# Altium project BMS Slave V0.1.PrjPcb (part 3 of 3)
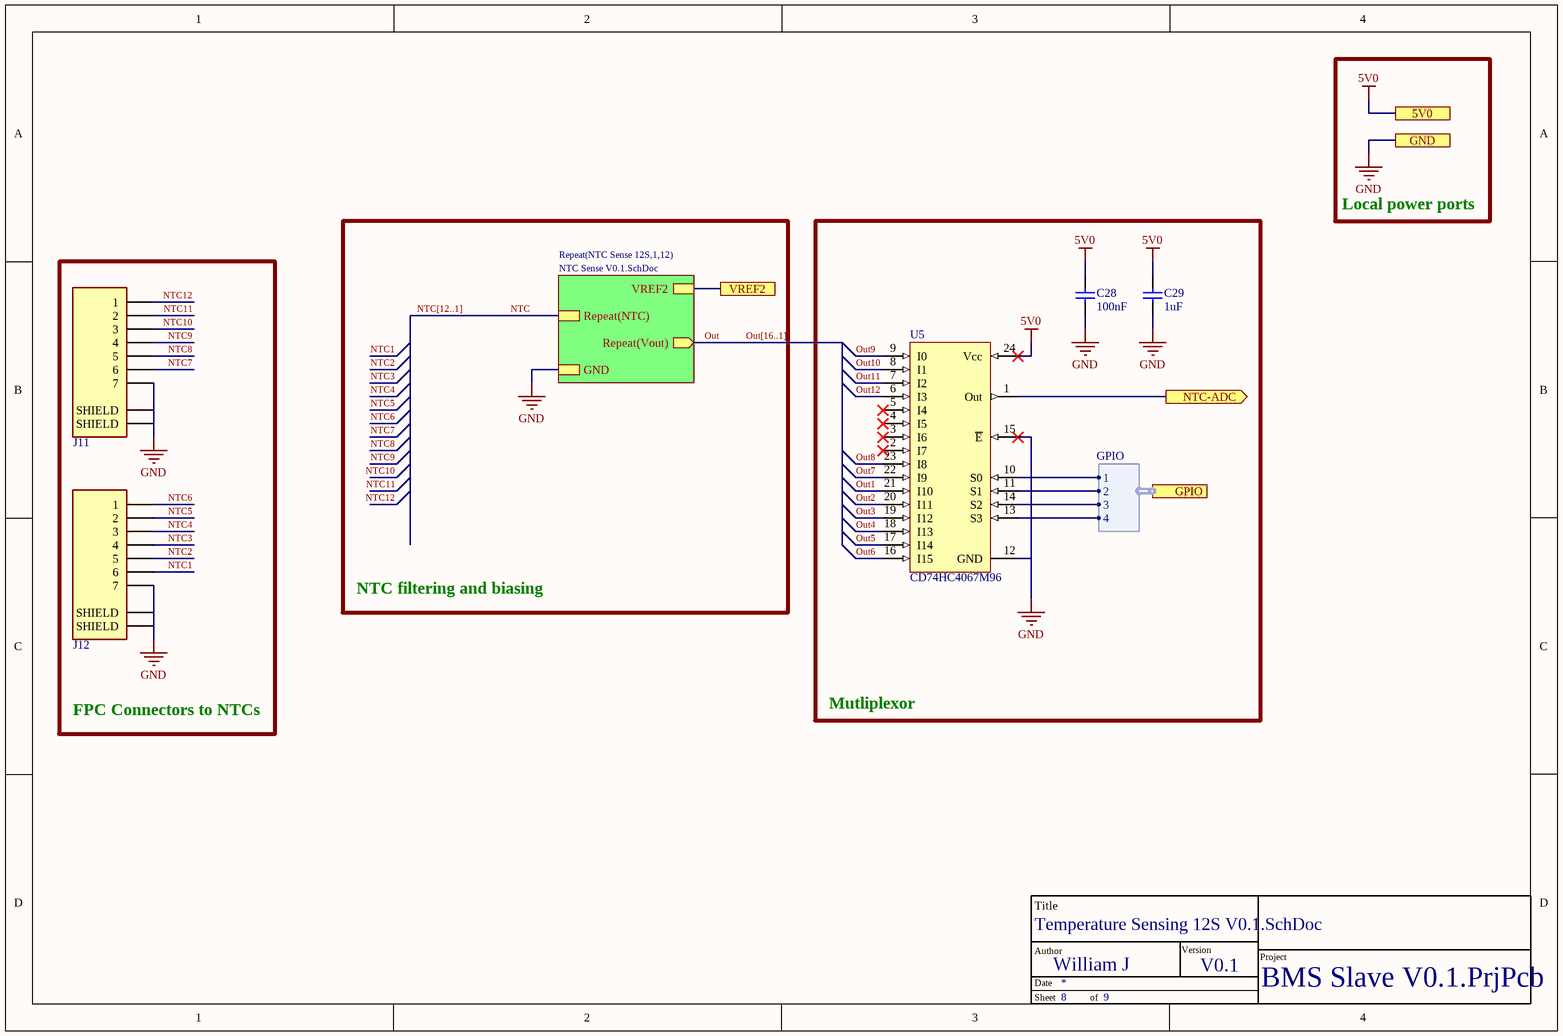
[diagram p9: Temperature Sensing 12S V0.1.SchDoc]

## Nets that join several sheets
5V0_8L: Cell Monitor 8S LHS V0.1 (14 pins), Temperature Sensing 8S LHS (C11_Temperature_Sensing_8S_LHS.1 C12_Temperature_Sensing_8S_LHS.2 U2_Temperature_Sensing_8S_LHS.24)
5V0_8R: Cell Monitor 8S RHS V0.1 (14 pins), Temperature Sensing 8S RHS (C11_Temperature_Sensing_8S_RHS.1 C12_Temperature_Sensing_8S_RHS.2 U2_Temperature_Sensing_8S_RHS.24)
5V0_12: Cell Monitor 12S V0.1 (14 pins), Temperature Sensing 12S V0.1 (C28.1 C29.2 U5.24)
GND_8L: Cell Monitor 8S LHS V0.1 (20 pins), Cell Monitor 8S LHS/Balance Circuit 8L1 (C8_Balance_Circuit_8L1.1), Cell Monitor 8S LHS/Balance Circuit 8L2 (C8_Balance_Circuit_8L2.1), Cell Monitor 8S LHS/Balance Circuit 8L3 (C8_Balance_Circuit_8L3.1), Cell Monitor 8S LHS/Balance Circuit 8L4 (C8_Balance_Circuit_8L4.1), Cell Monitor 8S LHS/Balance Circuit 8L5 (C8_Balance_Circuit_8L5.1), Cell Monitor 8S LHS/Balance Circuit 8L6 (C8_Balance_Circuit_8L6.1), Cell Monitor 8S LHS/Balance Circuit 8L7 (C8_Balance_Circuit_8L7.1), Cell Monitor 8S LHS/Balance Circuit 8L8 (C8_Balance_Circuit_8L8.1), Temperature Sensing 8S LHS (10 pins), Temperature Sensing 8S LHS/NTC Sense 8S1 (C13_Temperature_Sensing_8S_LHS_NTC_Sense_8S1.1), Temperature Sensing 8S LHS/NTC Sense 8S2 (C13_Temperature_Sensing_8S_LHS_NTC_Sense_8S2.1), Temperature Sensing 8S LHS/NTC Sense 8S3 (C13_Temperature_Sensing_8S_LHS_NTC_Sense_8S3.1), Temperature Sensing 8S LHS/NTC Sense 8S4 (C13_Temperature_Sensing_8S_LHS_NTC_Sense_8S4.1), Temperature Sensing 8S LHS/NTC Sense 8S5 (C13_Temperature_Sensing_8S_LHS_NTC_Sense_8S5.1), Temperature Sensing 8S LHS/NTC Sense 8S6 (C13_Temperature_Sensing_8S_LHS_NTC_Sense_8S6.1), Temperature Sensing 8S LHS/NTC Sense 8S7 (C13_Temperature_Sensing_8S_LHS_NTC_Sense_8S7.1), Temperature Sensing 8S LHS/NTC Sense 8S8 (C13_Temperature_Sensing_8S_LHS_NTC_Sense_8S8.1), Temperature Sensing 8S LHS/NTC Sense 8S9 (C13_Temperature_Sensing_8S_LHS_NTC_Sense_8S9.1), Temperature Sensing 8S LHS/NTC Sense 8S10 (C13_Temperature_Sensing_8S_LHS_NTC_Sense_8S10.1), Temperature Sensing 8S LHS/NTC Sense 8S11 (C13_Temperature_Sensing_8S_LHS_NTC_Sense_8S11.1), Temperature Sensing 8S LHS/NTC Sense 8S12 (C13_Temperature_Sensing_8S_LHS_NTC_Sense_8S12.1), Temperature Sensing 8S LHS/NTC Sense 8S13 (C13_Temperature_Sensing_8S_LHS_NTC_Sense_8S13.1), Temperature Sensing 8S LHS/NTC Sense 8S14 (C13_Temperature_Sensing_8S_LHS_NTC_Sense_8S14.1), Temperature Sensing 8S LHS/NTC Sense 8S15 (C13_Temperature_Sensing_8S_LHS_NTC_Sense_8S15.1), Temperature Sensing 8S LHS/NTC Sense 8S16 (C13_Temperature_Sensing_8S_LHS_NTC_Sense_8S16.1), IsoSPI 8S LHS (C10_IsoSPI_8S_LHS.1)
GND_8R: Cell Monitor 8S RHS V0.1 (20 pins), Cell Monitor 8S RHS/Balance Circuit 8R1 (C8_Balance_Circuit_8R1.1), Cell Monitor 8S RHS/Balance Circuit 8R2 (C8_Balance_Circuit_8R2.1), Cell Monitor 8S RHS/Balance Circuit 8R3 (C8_Balance_Circuit_8R3.1), Cell Monitor 8S RHS/Balance Circuit 8R4 (C8_Balance_Circuit_8R4.1), Cell Monitor 8S RHS/Balance Circuit 8R5 (C8_Balance_Circuit_8R5.1), Cell Monitor 8S RHS/Balance Circuit 8R6 (C8_Balance_Circuit_8R6.1), Cell Monitor 8S RHS/Balance Circuit 8R7 (C8_Balance_Circuit_8R7.1), Cell Monitor 8S RHS/Balance Circuit 8R8 (C8_Balance_Circuit_8R8.1), Temperature Sensing 8S RHS (10 pins), Temperature Sensing 8S RHS/NTC Sense 8S1 (C13_Temperature_Sensing_8S_RHS_NTC_Sense_8S1.1), Temperature Sensing 8S RHS/NTC Sense 8S2 (C13_Temperature_Sensing_8S_RHS_NTC_Sense_8S2.1), Temperature Sensing 8S RHS/NTC Sense 8S3 (C13_Temperature_Sensing_8S_RHS_NTC_Sense_8S3.1), Temperature Sensing 8S RHS/NTC Sense 8S4 (C13_Temperature_Sensing_8S_RHS_NTC_Sense_8S4.1), Temperature Sensing 8S RHS/NTC Sense 8S5 (C13_Temperature_Sensing_8S_RHS_NTC_Sense_8S5.1), Temperature Sensing 8S RHS/NTC Sense 8S6 (C13_Temperature_Sensing_8S_RHS_NTC_Sense_8S6.1), Temperature Sensing 8S RHS/NTC Sense 8S7 (C13_Temperature_Sensing_8S_RHS_NTC_Sense_8S7.1), Temperature Sensing 8S RHS/NTC Sense 8S8 (C13_Temperature_Sensing_8S_RHS_NTC_Sense_8S8.1), Temperature Sensing 8S RHS/NTC Sense 8S9 (C13_Temperature_Sensing_8S_RHS_NTC_Sense_8S9.1), Temperature Sensing 8S RHS/NTC Sense 8S10 (C13_Temperature_Sensing_8S_RHS_NTC_Sense_8S10.1), Temperature Sensing 8S RHS/NTC Sense 8S11 (C13_Temperature_Sensing_8S_RHS_NTC_Sense_8S11.1), Temperature Sensing 8S RHS/NTC Sense 8S12 (C13_Temperature_Sensing_8S_RHS_NTC_Sense_8S12.1), Temperature Sensing 8S RHS/NTC Sense 8S13 (C13_Temperature_Sensing_8S_RHS_NTC_Sense_8S13.1), Temperature Sensing 8S RHS/NTC Sense 8S14 (C13_Temperature_Sensing_8S_RHS_NTC_Sense_8S14.1), Temperature Sensing 8S RHS/NTC Sense 8S15 (C13_Temperature_Sensing_8S_RHS_NTC_Sense_8S15.1), Temperature Sensing 8S RHS/NTC Sense 8S16 (C13_Temperature_Sensing_8S_RHS_NTC_Sense_8S16.1), IsoSPI 8S RHS (C10_IsoSPI_8S_RHS.1)
GND_12: Cell Monitor 12S V0.1 (20 pins), Cell Monitor 12S/Balance Circuit 121 (C8_Balance_Circuit_121.1), Cell Monitor 12S/Balance Circuit 122 (C8_Balance_Circuit_122.1), Cell Monitor 12S/Balance Circuit 123 (C8_Balance_Circuit_123.1), Cell Monitor 12S/Balance Circuit 124 (C8_Balance_Circuit_124.1), Cell Monitor 12S/Balance Circuit 125 (C8_Balance_Circuit_125.1), Cell Monitor 12S/Balance Circuit 126 (C8_Balance_Circuit_126.1), Cell Monitor 12S/Balance Circuit 127 (C8_Balance_Circuit_127.1), Cell Monitor 12S/Balance Circuit 128 (C8_Balance_Circuit_128.1), Cell Monitor 12S/Balance Circuit 129 (C8_Balance_Circuit_129.1), Cell Monitor 12S/Balance Circuit 1210 (C8_Balance_Circuit_1210.1), Cell Monitor 12S/Balance Circuit 1211 (C8_Balance_Circuit_1211.1), Cell Monitor 12S/Balance Circuit 1212 (C8_Balance_Circuit_1212.1), IsoSPI 12S (C10_IsoSPI_12S.1), Temperature Sensing 12S V0.1 (10 pins), Temperature Sensing 12S RHS/NTC Sense 12S1 (C13_NTC_Sense_12S1.1), Temperature Sensing 12S RHS/NTC Sense 12S2 (C13_NTC_Sense_12S2.1), Temperature Sensing 12S RHS/NTC Sense 12S3 (C13_NTC_Sense_12S3.1), Temperature Sensing 12S RHS/NTC Sense 12S4 (C13_NTC_Sense_12S4.1), Temperature Sensing 12S RHS/NTC Sense 12S5 (C13_NTC_Sense_12S5.1), Temperature Sensing 12S RHS/NTC Sense 12S6 (C13_NTC_Sense_12S6.1), Temperature Sensing 12S RHS/NTC Sense 12S7 (C13_NTC_Sense_12S7.1), Temperature Sensing 12S RHS/NTC Sense 12S8 (C13_NTC_Sense_12S8.1), Temperature Sensing 12S RHS/NTC Sense 12S9 (C13_NTC_Sense_12S9.1), Temperature Sensing 12S RHS/NTC Sense 12S10 (C13_NTC_Sense_12S10.1), Temperature Sensing 12S RHS/NTC Sense 12S11 (C13_NTC_Sense_12S11.1), Temperature Sensing 12S RHS/NTC Sense 12S12 (C13_NTC_Sense_12S12.1)
VREF8L_2: Cell Monitor 8S LHS V0.1 (C17.2 C18.2 TP9.1 U3.34), Temperature Sensing 8S LHS/NTC Sense 8S1 (R25_Temperature_Sensing_8S_LHS_NTC_Sense_8S1.2), Temperature Sensing 8S LHS/NTC Sense 8S2 (R25_Temperature_Sensing_8S_LHS_NTC_Sense_8S2.2), Temperature Sensing 8S LHS/NTC Sense 8S3 (R25_Temperature_Sensing_8S_LHS_NTC_Sense_8S3.2), Temperature Sensing 8S LHS/NTC Sense 8S4 (R25_Temperature_Sensing_8S_LHS_NTC_Sense_8S4.2), Temperature Sensing 8S LHS/NTC Sense 8S5 (R25_Temperature_Sensing_8S_LHS_NTC_Sense_8S5.2), Temperature Sensing 8S LHS/NTC Sense 8S6 (R25_Temperature_Sensing_8S_LHS_NTC_Sense_8S6.2), Temperature Sensing 8S LHS/NTC Sense 8S7 (R25_Temperature_Sensing_8S_LHS_NTC_Sense_8S7.2), Temperature Sensing 8S LHS/NTC Sense 8S8 (R25_Temperature_Sensing_8S_LHS_NTC_Sense_8S8.2), Temperature Sensing 8S LHS/NTC Sense 8S9 (R25_Temperature_Sensing_8S_LHS_NTC_Sense_8S9.2), Temperature Sensing 8S LHS/NTC Sense 8S10 (R25_Temperature_Sensing_8S_LHS_NTC_Sense_8S10.2), Temperature Sensing 8S LHS/NTC Sense 8S11 (R25_Temperature_Sensing_8S_LHS_NTC_Sense_8S11.2), Temperature Sensing 8S LHS/NTC Sense 8S12 (R25_Temperature_Sensing_8S_LHS_NTC_Sense_8S12.2), Temperature Sensing 8S LHS/NTC Sense 8S13 (R25_Temperature_Sensing_8S_LHS_NTC_Sense_8S13.2), Temperature Sensing 8S LHS/NTC Sense 8S14 (R25_Temperature_Sensing_8S_LHS_NTC_Sense_8S14.2), Temperature Sensing 8S LHS/NTC Sense 8S15 (R25_Temperature_Sensing_8S_LHS_NTC_Sense_8S15.2), Temperature Sensing 8S LHS/NTC Sense 8S16 (R25_Temperature_Sensing_8S_LHS_NTC_Sense_8S16.2)
VREF8R_2: Cell Monitor 8S RHS V0.1 (C24.2 C25.2 TP16.1 U4.34), Temperature Sensing 8S RHS/NTC Sense 8S1 (R25_Temperature_Sensing_8S_RHS_NTC_Sense_8S1.2), Temperature Sensing 8S RHS/NTC Sense 8S2 (R25_Temperature_Sensing_8S_RHS_NTC_Sense_8S2.2), Temperature Sensing 8S RHS/NTC Sense 8S3 (R25_Temperature_Sensing_8S_RHS_NTC_Sense_8S3.2), Temperature Sensing 8S RHS/NTC Sense 8S4 (R25_Temperature_Sensing_8S_RHS_NTC_Sense_8S4.2), Temperature Sensing 8S RHS/NTC Sense 8S5 (R25_Temperature_Sensing_8S_RHS_NTC_Sense_8S5.2), Temperature Sensing 8S RHS/NTC Sense 8S6 (R25_Temperature_Sensing_8S_RHS_NTC_Sense_8S6.2), Temperature Sensing 8S RHS/NTC Sense 8S7 (R25_Temperature_Sensing_8S_RHS_NTC_Sense_8S7.2), Temperature Sensing 8S RHS/NTC Sense 8S8 (R25_Temperature_Sensing_8S_RHS_NTC_Sense_8S8.2), Temperature Sensing 8S RHS/NTC Sense 8S9 (R25_Temperature_Sensing_8S_RHS_NTC_Sense_8S9.2), Temperature Sensing 8S RHS/NTC Sense 8S10 (R25_Temperature_Sensing_8S_RHS_NTC_Sense_8S10.2), Temperature Sensing 8S RHS/NTC Sense 8S11 (R25_Temperature_Sensing_8S_RHS_NTC_Sense_8S11.2), Temperature Sensing 8S RHS/NTC Sense 8S12 (R25_Temperature_Sensing_8S_RHS_NTC_Sense_8S12.2), Temperature Sensing 8S RHS/NTC Sense 8S13 (R25_Temperature_Sensing_8S_RHS_NTC_Sense_8S13.2), Temperature Sensing 8S RHS/NTC Sense 8S14 (R25_Temperature_Sensing_8S_RHS_NTC_Sense_8S14.2), Temperature Sensing 8S RHS/NTC Sense 8S15 (R25_Temperature_Sensing_8S_RHS_NTC_Sense_8S15.2), Temperature Sensing 8S RHS/NTC Sense 8S16 (R25_Temperature_Sensing_8S_RHS_NTC_Sense_8S16.2)
VREF12_2: Cell Monitor 12S V0.1 (C4.2 C5.2 TP2.1 U1.34), Temperature Sensing 12S RHS/NTC Sense 12S1 (R25_NTC_Sense_12S1.2), Temperature Sensing 12S RHS/NTC Sense 12S2 (R25_NTC_Sense_12S2.2), Temperature Sensing 12S RHS/NTC Sense 12S3 (R25_NTC_Sense_12S3.2), Temperature Sensing 12S RHS/NTC Sense 12S4 (R25_NTC_Sense_12S4.2), Temperature Sensing 12S RHS/NTC Sense 12S5 (R25_NTC_Sense_12S5.2), Temperature Sensing 12S RHS/NTC Sense 12S6 (R25_NTC_Sense_12S6.2), Temperature Sensing 12S RHS/NTC Sense 12S7 (R25_NTC_Sense_12S7.2), Temperature Sensing 12S RHS/NTC Sense 12S8 (R25_NTC_Sense_12S8.2), Temperature Sensing 12S RHS/NTC Sense 12S9 (R25_NTC_Sense_12S9.2), Temperature Sensing 12S RHS/NTC Sense 12S10 (R25_NTC_Sense_12S10.2), Temperature Sensing 12S RHS/NTC Sense 12S11 (R25_NTC_Sense_12S11.2), Temperature Sensing 12S RHS/NTC Sense 12S12 (R25_NTC_Sense_12S12.2)
B8L_1: Cell Monitor 8S LHS V0.1 (NT3.2), Cell Monitor 8S LHS/Balance Circuit 8L1 (R21_Balance_Circuit_8L1.1 R22_Balance_Circuit_8L1.1)
B8L_2: Cell Monitor 8S LHS/Balance Circuit 8L1 (F2_Balance_Circuit_8L1.2 Q2_Balance_Circuit_8L1.2 R19_Balance_Circuit_8L1.1), Cell Monitor 8S LHS/Balance Circuit 8L2 (R21_Balance_Circuit_8L2.1 R22_Balance_Circuit_8L2.1)
B8L_3: Cell Monitor 8S LHS/Balance Circuit 8L2 (F2_Balance_Circuit_8L2.2 Q2_Balance_Circuit_8L2.2 R19_Balance_Circuit_8L2.1), Cell Monitor 8S LHS/Balance Circuit 8L3 (R21_Balance_Circuit_8L3.1 R22_Balance_Circuit_8L3.1)
B8L_4: Cell Monitor 8S LHS/Balance Circuit 8L3 (F2_Balance_Circuit_8L3.2 Q2_Balance_Circuit_8L3.2 R19_Balance_Circuit_8L3.1), Cell Monitor 8S LHS/Balance Circuit 8L4 (R21_Balance_Circuit_8L4.1 R22_Balance_Circuit_8L4.1)
B8L_5: Cell Monitor 8S LHS/Balance Circuit 8L4 (F2_Balance_Circuit_8L4.2 Q2_Balance_Circuit_8L4.2 R19_Balance_Circuit_8L4.1), Cell Monitor 8S LHS/Balance Circuit 8L5 (R21_Balance_Circuit_8L5.1 R22_Balance_Circuit_8L5.1)
B8L_6: Cell Monitor 8S LHS/Balance Circuit 8L5 (F2_Balance_Circuit_8L5.2 Q2_Balance_Circuit_8L5.2 R19_Balance_Circuit_8L5.1), Cell Monitor 8S LHS/Balance Circuit 8L6 (R21_Balance_Circuit_8L6.1 R22_Balance_Circuit_8L6.1)
B8L_7: Cell Monitor 8S LHS/Balance Circuit 8L6 (F2_Balance_Circuit_8L6.2 Q2_Balance_Circuit_8L6.2 R19_Balance_Circuit_8L6.1), Cell Monitor 8S LHS/Balance Circuit 8L7 (R21_Balance_Circuit_8L7.1 R22_Balance_Circuit_8L7.1)
B8L_8: Cell Monitor 8S LHS/Balance Circuit 8L7 (F2_Balance_Circuit_8L7.2 Q2_Balance_Circuit_8L7.2 R19_Balance_Circuit_8L7.1), Cell Monitor 8S LHS/Balance Circuit 8L8 (R21_Balance_Circuit_8L8.1 R22_Balance_Circuit_8L8.1)
B8R_1: Cell Monitor 8S RHS V0.1 (NT5.2), Cell Monitor 8S RHS/Balance Circuit 8R1 (R21_Balance_Circuit_8R1.1 R22_Balance_Circuit_8R1.1)
B8R_2: Cell Monitor 8S RHS/Balance Circuit 8R1 (F2_Balance_Circuit_8R1.2 Q2_Balance_Circuit_8R1.2 R19_Balance_Circuit_8R1.1), Cell Monitor 8S RHS/Balance Circuit 8R2 (R21_Balance_Circuit_8R2.1 R22_Balance_Circuit_8R2.1)
B8R_3: Cell Monitor 8S RHS/Balance Circuit 8R2 (F2_Balance_Circuit_8R2.2 Q2_Balance_Circuit_8R2.2 R19_Balance_Circuit_8R2.1), Cell Monitor 8S RHS/Balance Circuit 8R3 (R21_Balance_Circuit_8R3.1 R22_Balance_Circuit_8R3.1)
B8R_4: Cell Monitor 8S RHS/Balance Circuit 8R3 (F2_Balance_Circuit_8R3.2 Q2_Balance_Circuit_8R3.2 R19_Balance_Circuit_8R3.1), Cell Monitor 8S RHS/Balance Circuit 8R4 (R21_Balance_Circuit_8R4.1 R22_Balance_Circuit_8R4.1)
B8R_5: Cell Monitor 8S RHS/Balance Circuit 8R4 (F2_Balance_Circuit_8R4.2 Q2_Balance_Circuit_8R4.2 R19_Balance_Circuit_8R4.1), Cell Monitor 8S RHS/Balance Circuit 8R5 (R21_Balance_Circuit_8R5.1 R22_Balance_Circuit_8R5.1)
B8R_6: Cell Monitor 8S RHS/Balance Circuit 8R5 (F2_Balance_Circuit_8R5.2 Q2_Balance_Circuit_8R5.2 R19_Balance_Circuit_8R5.1), Cell Monitor 8S RHS/Balance Circuit 8R6 (R21_Balance_Circuit_8R6.1 R22_Balance_Circuit_8R6.1)
B8R_7: Cell Monitor 8S RHS/Balance Circuit 8R6 (F2_Balance_Circuit_8R6.2 Q2_Balance_Circuit_8R6.2 R19_Balance_Circuit_8R6.1), Cell Monitor 8S RHS/Balance Circuit 8R7 (R21_Balance_Circuit_8R7.1 R22_Balance_Circuit_8R7.1)
B8R_8: Cell Monitor 8S RHS/Balance Circuit 8R7 (F2_Balance_Circuit_8R7.2 Q2_Balance_Circuit_8R7.2 R19_Balance_Circuit_8R7.1), Cell Monitor 8S RHS/Balance Circuit 8R8 (R21_Balance_Circuit_8R8.1 R22_Balance_Circuit_8R8.1)
B12_1: Cell Monitor 12S V0.1 (NT1.2), Cell Monitor 12S/Balance Circuit 121 (R21_Balance_Circuit_121.1 R22_Balance_Circuit_121.1)
B12_2: Cell Monitor 12S/Balance Circuit 121 (F2_Balance_Circuit_121.2 Q2_Balance_Circuit_121.2 R19_Balance_Circuit_121.1), Cell Monitor 12S/Balance Circuit 122 (R21_Balance_Circuit_122.1 R22_Balance_Circuit_122.1)
B12_3: Cell Monitor 12S/Balance Circuit 122 (F2_Balance_Circuit_122.2 Q2_Balance_Circuit_122.2 R19_Balance_Circuit_122.1), Cell Monitor 12S/Balance Circuit 123 (R21_Balance_Circuit_123.1 R22_Balance_Circuit_123.1)
B12_4: Cell Monitor 12S/Balance Circuit 123 (F2_Balance_Circuit_123.2 Q2_Balance_Circuit_123.2 R19_Balance_Circuit_123.1), Cell Monitor 12S/Balance Circuit 124 (R21_Balance_Circuit_124.1 R22_Balance_Circuit_124.1)
B12_5: Cell Monitor 12S/Balance Circuit 124 (F2_Balance_Circuit_124.2 Q2_Balance_Circuit_124.2 R19_Balance_Circuit_124.1), Cell Monitor 12S/Balance Circuit 125 (R21_Balance_Circuit_125.1 R22_Balance_Circuit_125.1)
B12_6: Cell Monitor 12S/Balance Circuit 125 (F2_Balance_Circuit_125.2 Q2_Balance_Circuit_125.2 R19_Balance_Circuit_125.1), Cell Monitor 12S/Balance Circuit 126 (R21_Balance_Circuit_126.1 R22_Balance_Circuit_126.1)
B12_7: Cell Monitor 12S/Balance Circuit 126 (F2_Balance_Circuit_126.2 Q2_Balance_Circuit_126.2 R19_Balance_Circuit_126.1), Cell Monitor 12S/Balance Circuit 127 (R21_Balance_Circuit_127.1 R22_Balance_Circuit_127.1)
B12_8: Cell Monitor 12S/Balance Circuit 127 (F2_Balance_Circuit_127.2 Q2_Balance_Circuit_127.2 R19_Balance_Circuit_127.1), Cell Monitor 12S/Balance Circuit 128 (R21_Balance_Circuit_128.1 R22_Balance_Circuit_128.1)
B12_9: Cell Monitor 12S/Balance Circuit 128 (F2_Balance_Circuit_128.2 Q2_Balance_Circuit_128.2 R19_Balance_Circuit_128.1), Cell Monitor 12S/Balance Circuit 129 (R21_Balance_Circuit_129.1 R22_Balance_Circuit_129.1)
B12_10: Cell Monitor 12S/Balance Circuit 129 (F2_Balance_Circuit_129.2 Q2_Balance_Circuit_129.2 R19_Balance_Circuit_129.1), Cell Monitor 12S/Balance Circuit 1210 (R21_Balance_Circuit_1210.1 R22_Balance_Circuit_1210.1)
B12_11: Cell Monitor 12S/Balance Circuit 1210 (F2_Balance_Circuit_1210.2 Q2_Balance_Circuit_1210.2 R19_Balance_Circuit_1210.1), Cell Monitor 12S/Balance Circuit 1211 (R21_Balance_Circuit_1211.1 R22_Balance_Circuit_1211.1)
B12_12: Cell Monitor 12S/Balance Circuit 1211 (F2_Balance_Circuit_1211.2 Q2_Balance_Circuit_1211.2 R19_Balance_Circuit_1211.1), Cell Monitor 12S/Balance Circuit 1212 (R21_Balance_Circuit_1212.1 R22_Balance_Circuit_1212.1)
C8L_1: Cell Monitor 8S LHS V0.1 (U3.24), Cell Monitor 8S LHS/Balance Circuit 8L1 (C8_Balance_Circuit_8L1.2 R19_Balance_Circuit_8L1.2)
C8L_2: Cell Monitor 8S LHS V0.1 (U3.22), Cell Monitor 8S LHS/Balance Circuit 8L2 (C8_Balance_Circuit_8L2.2 R19_Balance_Circuit_8L2.2)
C8L_3: Cell Monitor 8S LHS V0.1 (U3.20), Cell Monitor 8S LHS/Balance Circuit 8L3 (C8_Balance_Circuit_8L3.2 R19_Balance_Circuit_8L3.2)
C8L_4: Cell Monitor 8S LHS V0.1 (U3.14 U3.16 U3.18), Cell Monitor 8S LHS/Balance Circuit 8L4 (C8_Balance_Circuit_8L4.2 R19_Balance_Circuit_8L4.2)
C8L_5: Cell Monitor 8S LHS V0.1 (U3.12), Cell Monitor 8S LHS/Balance Circuit 8L5 (C8_Balance_Circuit_8L5.2 R19_Balance_Circuit_8L5.2)
C8L_6: Cell Monitor 8S LHS V0.1 (U3.10), Cell Monitor 8S LHS/Balance Circuit 8L6 (C8_Balance_Circuit_8L6.2 R19_Balance_Circuit_8L6.2)
C8L_7: Cell Monitor 8S LHS V0.1 (U3.8), Cell Monitor 8S LHS/Balance Circuit 8L7 (C8_Balance_Circuit_8L7.2 R19_Balance_Circuit_8L7.2)
C8L_8: Cell Monitor 8S LHS V0.1 (U3.2 U3.4 U3.6), Cell Monitor 8S LHS/Balance Circuit 8L8 (C8_Balance_Circuit_8L8.2 R19_Balance_Circuit_8L8.2)
C8R_1: Cell Monitor 8S RHS V0.1 (U4.24), Cell Monitor 8S RHS/Balance Circuit 8R1 (C8_Balance_Circuit_8R1.2 R19_Balance_Circuit_8R1.2)
C8R_2: Cell Monitor 8S RHS V0.1 (U4.22), Cell Monitor 8S RHS/Balance Circuit 8R2 (C8_Balance_Circuit_8R2.2 R19_Balance_Circuit_8R2.2)
C8R_3: Cell Monitor 8S RHS V0.1 (U4.20), Cell Monitor 8S RHS/Balance Circuit 8R3 (C8_Balance_Circuit_8R3.2 R19_Balance_Circuit_8R3.2)
C8R_4: Cell Monitor 8S RHS V0.1 (U4.14 U4.16 U4.18), Cell Monitor 8S RHS/Balance Circuit 8R4 (C8_Balance_Circuit_8R4.2 R19_Balance_Circuit_8R4.2)
C8R_5: Cell Monitor 8S RHS V0.1 (U4.12), Cell Monitor 8S RHS/Balance Circuit 8R5 (C8_Balance_Circuit_8R5.2 R19_Balance_Circuit_8R5.2)
C8R_6: Cell Monitor 8S RHS V0.1 (U4.10), Cell Monitor 8S RHS/Balance Circuit 8R6 (C8_Balance_Circuit_8R6.2 R19_Balance_Circuit_8R6.2)
C8R_7: Cell Monitor 8S RHS V0.1 (U4.8), Cell Monitor 8S RHS/Balance Circuit 8R7 (C8_Balance_Circuit_8R7.2 R19_Balance_Circuit_8R7.2)
C8R_8: Cell Monitor 8S RHS V0.1 (U4.2 U4.4 U4.6), Cell Monitor 8S RHS/Balance Circuit 8R8 (C8_Balance_Circuit_8R8.2 R19_Balance_Circuit_8R8.2)
C12_1: Cell Monitor 12S V0.1 (U1.24), Cell Monitor 12S/Balance Circuit 121 (C8_Balance_Circuit_121.2 R19_Balance_Circuit_121.2)
C12_2: Cell Monitor 12S V0.1 (U1.22), Cell Monitor 12S/Balance Circuit 122 (C8_Balance_Circuit_122.2 R19_Balance_Circuit_122.2)
C12_3: Cell Monitor 12S V0.1 (U1.20), Cell Monitor 12S/Balance Circuit 123 (C8_Balance_Circuit_123.2 R19_Balance_Circuit_123.2)
C12_4: Cell Monitor 12S V0.1 (U1.18), Cell Monitor 12S/Balance Circuit 124 (C8_Balance_Circuit_124.2 R19_Balance_Circuit_124.2)
C12_5: Cell Monitor 12S V0.1 (U1.16), Cell Monitor 12S/Balance Circuit 125 (C8_Balance_Circuit_125.2 R19_Balance_Circuit_125.2)
C12_6: Cell Monitor 12S V0.1 (U1.14), Cell Monitor 12S/Balance Circuit 126 (C8_Balance_Circuit_126.2 R19_Balance_Circuit_126.2)
C12_7: Cell Monitor 12S V0.1 (U1.12), Cell Monitor 12S/Balance Circuit 127 (C8_Balance_Circuit_127.2 R19_Balance_Circuit_127.2)
C12_8: Cell Monitor 12S V0.1 (U1.10), Cell Monitor 12S/Balance Circuit 128 (C8_Balance_Circuit_128.2 R19_Balance_Circuit_128.2)
C12_9: Cell Monitor 12S V0.1 (U1.8), Cell Monitor 12S/Balance Circuit 129 (C8_Balance_Circuit_129.2 R19_Balance_Circuit_129.2)
C12_10: Cell Monitor 12S V0.1 (U1.6), Cell Monitor 12S/Balance Circuit 1210 (C8_Balance_Circuit_1210.2 R19_Balance_Circuit_1210.2)
C12_11: Cell Monitor 12S V0.1 (U1.4), Cell Monitor 12S/Balance Circuit 1211 (C8_Balance_Circuit_1211.2 R19_Balance_Circuit_1211.2)
C12_12: Cell Monitor 12S V0.1 (U1.2), Cell Monitor 12S/Balance Circuit 1212 (C8_Balance_Circuit_1212.2 R19_Balance_Circuit_1212.2)
GPIO8L.1: Cell Monitor 8S LHS V0.1 (U3.27), Temperature Sensing 8S LHS (U2_Temperature_Sensing_8S_LHS.10)
GPIO8L.2: Cell Monitor 8S LHS V0.1 (U3.28), Temperature Sensing 8S LHS (U2_Temperature_Sensing_8S_LHS.11)
GPIO8L.3: Cell Monitor 8S LHS V0.1 (U3.29), Temperature Sensing 8S LHS (U2_Temperature_Sensing_8S_LHS.14)
GPIO8L.4: Cell Monitor 8S LHS V0.1 (U3.32), Temperature Sensing 8S LHS (U2_Temperature_Sensing_8S_LHS.13)
GPIO8R.1: Cell Monitor 8S RHS V0.1 (U4.27), Temperature Sensing 8S RHS (U2_Temperature_Sensing_8S_RHS.10)
GPIO8R.2: Cell Monitor 8S RHS V0.1 (U4.28), Temperature Sensing 8S RHS (U2_Temperature_Sensing_8S_RHS.11)
GPIO8R.3: Cell Monitor 8S RHS V0.1 (U4.29), Temperature Sensing 8S RHS (U2_Temperature_Sensing_8S_RHS.14)
GPIO8R.4: Cell Monitor 8S RHS V0.1 (U4.32), Temperature Sensing 8S RHS (U2_Temperature_Sensing_8S_RHS.13)
GPIO12.1: Cell Monitor 12S V0.1 (U1.27), Temperature Sensing 12S V0.1 (U5.10)
GPIO12.2: Cell Monitor 12S V0.1 (U1.28), Temperature Sensing 12S V0.1 (U5.11)
GPIO12.3: Cell Monitor 12S V0.1 (U1.29), Temperature Sensing 12S V0.1 (U5.14)
GPIO12.4: Cell Monitor 12S V0.1 (U1.32), Temperature Sensing 12S V0.1 (U5.13)
isoSPI._N: Cell Monitor 12S V0.1 (U1.41), IsoSPI 12S (C9_IsoSPI_12S.1 T1_IsoSPI_12S.4)
isoSPI._N: Cell Monitor 8S LHS V0.1 (U3.41), IsoSPI 8S LHS (C9_IsoSPI_8S_LHS.1 T1_IsoSPI_8S_LHS.4)
isoSPI._N: Cell Monitor 8S RHS V0.1 (U4.41), IsoSPI 8S RHS (C9_IsoSPI_8S_RHS.1 T1_IsoSPI_8S_RHS.4)
isoSPI._P: Cell Monitor 12S V0.1 (U1.42), IsoSPI 12S (R24_IsoSPI_12S.2 T1_IsoSPI_12S.6)
isoSPI._P: Cell Monitor 8S LHS V0.1 (U3.42), IsoSPI 8S LHS (R24_IsoSPI_8S_LHS.2 T1_IsoSPI_8S_LHS.6)
isoSPI._P: Cell Monitor 8S RHS V0.1 (U4.42), IsoSPI 8S RHS (R24_IsoSPI_8S_RHS.2 T1_IsoSPI_8S_RHS.6)
isoSPI_Bus_N: BMS Slave V0.1 (J3.1 R63.1 TP7.1), IsoSPI 12S (R64_IsoSPI_12S.1), IsoSPI 8S LHS (R64_IsoSPI_8S_LHS.1), IsoSPI 8S RHS (R64_IsoSPI_8S_RHS.1)
isoSPI_Bus_P: BMS Slave V0.1 (J3.2 R63.2 TP6.1), IsoSPI 12S (R23_IsoSPI_12S.1), IsoSPI 8S LHS (R23_IsoSPI_8S_LHS.1), IsoSPI 8S RHS (R23_IsoSPI_8S_RHS.1)
NetU1_33: Cell Monitor 12S V0.1 (U1.33), Temperature Sensing 12S V0.1 (U5.1)
NetU2_Temperature_Sensing_8S_LHS_1: Cell Monitor 8S LHS V0.1 (U3.33), Temperature Sensing 8S LHS (U2_Temperature_Sensing_8S_LHS.1)
NetU2_Temperature_Sensing_8S_RHS_1: Cell Monitor 8S RHS V0.1 (U4.33), Temperature Sensing 8S RHS (U2_Temperature_Sensing_8S_RHS.1)
NTC1: Temperature Sensing 12S V0.1 (J12.6), Temperature Sensing 12S RHS/NTC Sense 12S1 (R25_NTC_Sense_12S1.1 R26_NTC_Sense_12S1.2)
NTC1_Temperature Sensing 8S LHS: Temperature Sensing 8S LHS (J5_Temperature_Sensing_8S_LHS.7), Temperature Sensing 8S LHS/NTC Sense 8S1 (R25_Temperature_Sensing_8S_LHS_NTC_Sense_8S1.1 R26_Temperature_Sensing_8S_LHS_NTC_Sense_8S1.2)
NTC1_Temperature Sensing 8S RHS: Temperature Sensing 8S RHS (J5_Temperature_Sensing_8S_RHS.7), Temperature Sensing 8S RHS/NTC Sense 8S1 (R25_Temperature_Sensing_8S_RHS_NTC_Sense_8S1.1 R26_Temperature_Sensing_8S_RHS_NTC_Sense_8S1.2)
NTC2: Temperature Sensing 12S V0.1 (J12.5), Temperature Sensing 12S RHS/NTC Sense 12S2 (R25_NTC_Sense_12S2.1 R26_NTC_Sense_12S2.2)
NTC2_Temperature Sensing 8S LHS: Temperature Sensing 8S LHS (J5_Temperature_Sensing_8S_LHS.6), Temperature Sensing 8S LHS/NTC Sense 8S2 (R25_Temperature_Sensing_8S_LHS_NTC_Sense_8S2.1 R26_Temperature_Sensing_8S_LHS_NTC_Sense_8S2.2)
NTC2_Temperature Sensing 8S RHS: Temperature Sensing 8S RHS (J5_Temperature_Sensing_8S_RHS.6), Temperature Sensing 8S RHS/NTC Sense 8S2 (R25_Temperature_Sensing_8S_RHS_NTC_Sense_8S2.1 R26_Temperature_Sensing_8S_RHS_NTC_Sense_8S2.2)
NTC3: Temperature Sensing 12S V0.1 (J12.4), Temperature Sensing 12S RHS/NTC Sense 12S3 (R25_NTC_Sense_12S3.1 R26_NTC_Sense_12S3.2)
NTC3_Temperature Sensing 8S LHS: Temperature Sensing 8S LHS (J5_Temperature_Sensing_8S_LHS.5), Temperature Sensing 8S LHS/NTC Sense 8S3 (R25_Temperature_Sensing_8S_LHS_NTC_Sense_8S3.1 R26_Temperature_Sensing_8S_LHS_NTC_Sense_8S3.2)
NTC3_Temperature Sensing 8S RHS: Temperature Sensing 8S RHS (J5_Temperature_Sensing_8S_RHS.5), Temperature Sensing 8S RHS/NTC Sense 8S3 (R25_Temperature_Sensing_8S_RHS_NTC_Sense_8S3.1 R26_Temperature_Sensing_8S_RHS_NTC_Sense_8S3.2)
NTC4: Temperature Sensing 12S V0.1 (J12.3), Temperature Sensing 12S RHS/NTC Sense 12S4 (R25_NTC_Sense_12S4.1 R26_NTC_Sense_12S4.2)
NTC4_Temperature Sensing 8S LHS: Temperature Sensing 8S LHS (J5_Temperature_Sensing_8S_LHS.4), Temperature Sensing 8S LHS/NTC Sense 8S4 (R25_Temperature_Sensing_8S_LHS_NTC_Sense_8S4.1 R26_Temperature_Sensing_8S_LHS_NTC_Sense_8S4.2)
NTC4_Temperature Sensing 8S RHS: Temperature Sensing 8S RHS (J5_Temperature_Sensing_8S_RHS.4), Temperature Sensing 8S RHS/NTC Sense 8S4 (R25_Temperature_Sensing_8S_RHS_NTC_Sense_8S4.1 R26_Temperature_Sensing_8S_RHS_NTC_Sense_8S4.2)
NTC5: Temperature Sensing 12S V0.1 (J12.2), Temperature Sensing 12S RHS/NTC Sense 12S5 (R25_NTC_Sense_12S5.1 R26_NTC_Sense_12S5.2)
NTC5_Temperature Sensing 8S LHS: Temperature Sensing 8S LHS (J5_Temperature_Sensing_8S_LHS.3), Temperature Sensing 8S LHS/NTC Sense 8S5 (R25_Temperature_Sensing_8S_LHS_NTC_Sense_8S5.1 R26_Temperature_Sensing_8S_LHS_NTC_Sense_8S5.2)
NTC5_Temperature Sensing 8S RHS: Temperature Sensing 8S RHS (J5_Temperature_Sensing_8S_RHS.3), Temperature Sensing 8S RHS/NTC Sense 8S5 (R25_Temperature_Sensing_8S_RHS_NTC_Sense_8S5.1 R26_Temperature_Sensing_8S_RHS_NTC_Sense_8S5.2)
NTC6: Temperature Sensing 12S V0.1 (J12.1), Temperature Sensing 12S RHS/NTC Sense 12S6 (R25_NTC_Sense_12S6.1 R26_NTC_Sense_12S6.2)
NTC6_Temperature Sensing 8S LHS: Temperature Sensing 8S LHS (J5_Temperature_Sensing_8S_LHS.2), Temperature Sensing 8S LHS/NTC Sense 8S6 (R25_Temperature_Sensing_8S_LHS_NTC_Sense_8S6.1 R26_Temperature_Sensing_8S_LHS_NTC_Sense_8S6.2)
NTC6_Temperature Sensing 8S RHS: Temperature Sensing 8S RHS (J5_Temperature_Sensing_8S_RHS.2), Temperature Sensing 8S RHS/NTC Sense 8S6 (R25_Temperature_Sensing_8S_RHS_NTC_Sense_8S6.1 R26_Temperature_Sensing_8S_RHS_NTC_Sense_8S6.2)
NTC7: Temperature Sensing 12S V0.1 (J11.6), Temperature Sensing 12S RHS/NTC Sense 12S7 (R25_NTC_Sense_12S7.1 R26_NTC_Sense_12S7.2)
NTC7_Temperature Sensing 8S LHS: Temperature Sensing 8S LHS (J5_Temperature_Sensing_8S_LHS.1), Temperature Sensing 8S LHS/NTC Sense 8S7 (R25_Temperature_Sensing_8S_LHS_NTC_Sense_8S7.1 R26_Temperature_Sensing_8S_LHS_NTC_Sense_8S7.2)
NTC7_Temperature Sensing 8S RHS: Temperature Sensing 8S RHS (J5_Temperature_Sensing_8S_RHS.1), Temperature Sensing 8S RHS/NTC Sense 8S7 (R25_Temperature_Sensing_8S_RHS_NTC_Sense_8S7.1 R26_Temperature_Sensing_8S_RHS_NTC_Sense_8S7.2)
NTC8: Temperature Sensing 12S V0.1 (J11.5), Temperature Sensing 12S RHS/NTC Sense 12S8 (R25_NTC_Sense_12S8.1 R26_NTC_Sense_12S8.2)
NTC8_Temperature Sensing 8S LHS: Temperature Sensing 8S LHS (J4_Temperature_Sensing_8S_LHS.9), Temperature Sensing 8S LHS/NTC Sense 8S8 (R25_Temperature_Sensing_8S_LHS_NTC_Sense_8S8.1 R26_Temperature_Sensing_8S_LHS_NTC_Sense_8S8.2)
NTC8_Temperature Sensing 8S RHS: Temperature Sensing 8S RHS (J4_Temperature_Sensing_8S_RHS.9), Temperature Sensing 8S RHS/NTC Sense 8S8 (R25_Temperature_Sensing_8S_RHS_NTC_Sense_8S8.1 R26_Temperature_Sensing_8S_RHS_NTC_Sense_8S8.2)
NTC9: Temperature Sensing 12S V0.1 (J11.4), Temperature Sensing 12S RHS/NTC Sense 12S9 (R25_NTC_Sense_12S9.1 R26_NTC_Sense_12S9.2)
NTC9_Temperature Sensing 8S LHS: Temperature Sensing 8S LHS (J4_Temperature_Sensing_8S_LHS.8), Temperature Sensing 8S LHS/NTC Sense 8S9 (R25_Temperature_Sensing_8S_LHS_NTC_Sense_8S9.1 R26_Temperature_Sensing_8S_LHS_NTC_Sense_8S9.2)
NTC9_Temperature Sensing 8S RHS: Temperature Sensing 8S RHS (J4_Temperature_Sensing_8S_RHS.8), Temperature Sensing 8S RHS/NTC Sense 8S9 (R25_Temperature_Sensing_8S_RHS_NTC_Sense_8S9.1 R26_Temperature_Sensing_8S_RHS_NTC_Sense_8S9.2)
NTC10: Temperature Sensing 12S V0.1 (J11.3), Temperature Sensing 12S RHS/NTC Sense 12S10 (R25_NTC_Sense_12S10.1 R26_NTC_Sense_12S10.2)
NTC10_Temperature Sensing 8S LHS: Temperature Sensing 8S LHS (J4_Temperature_Sensing_8S_LHS.7), Temperature Sensing 8S LHS/NTC Sense 8S10 (R25_Temperature_Sensing_8S_LHS_NTC_Sense_8S10.1 R26_Temperature_Sensing_8S_LHS_NTC_Sense_8S10.2)
NTC10_Temperature Sensing 8S RHS: Temperature Sensing 8S RHS (J4_Temperature_Sensing_8S_RHS.7), Temperature Sensing 8S RHS/NTC Sense 8S10 (R25_Temperature_Sensing_8S_RHS_NTC_Sense_8S10.1 R26_Temperature_Sensing_8S_RHS_NTC_Sense_8S10.2)
NTC11: Temperature Sensing 12S V0.1 (J11.2), Temperature Sensing 12S RHS/NTC Sense 12S11 (R25_NTC_Sense_12S11.1 R26_NTC_Sense_12S11.2)
NTC11_Temperature Sensing 8S LHS: Temperature Sensing 8S LHS (J4_Temperature_Sensing_8S_LHS.6), Temperature Sensing 8S LHS/NTC Sense 8S11 (R25_Temperature_Sensing_8S_LHS_NTC_Sense_8S11.1 R26_Temperature_Sensing_8S_LHS_NTC_Sense_8S11.2)
NTC11_Temperature Sensing 8S RHS: Temperature Sensing 8S RHS (J4_Temperature_Sensing_8S_RHS.6), Temperature Sensing 8S RHS/NTC Sense 8S11 (R25_Temperature_Sensing_8S_RHS_NTC_Sense_8S11.1 R26_Temperature_Sensing_8S_RHS_NTC_Sense_8S11.2)
NTC12: Temperature Sensing 12S V0.1 (J11.1), Temperature Sensing 12S RHS/NTC Sense 12S12 (R25_NTC_Sense_12S12.1 R26_NTC_Sense_12S12.2)
NTC12_Temperature Sensing 8S LHS: Temperature Sensing 8S LHS (J4_Temperature_Sensing_8S_LHS.5), Temperature Sensing 8S LHS/NTC Sense 8S12 (R25_Temperature_Sensing_8S_LHS_NTC_Sense_8S12.1 R26_Temperature_Sensing_8S_LHS_NTC_Sense_8S12.2)
NTC12_Temperature Sensing 8S RHS: Temperature Sensing 8S RHS (J4_Temperature_Sensing_8S_RHS.5), Temperature Sensing 8S RHS/NTC Sense 8S12 (R25_Temperature_Sensing_8S_RHS_NTC_Sense_8S12.1 R26_Temperature_Sensing_8S_RHS_NTC_Sense_8S12.2)
NTC13_Temperature Sensing 8S LHS: Temperature Sensing 8S LHS (J4_Temperature_Sensing_8S_LHS.4), Temperature Sensing 8S LHS/NTC Sense 8S13 (R25_Temperature_Sensing_8S_LHS_NTC_Sense_8S13.1 R26_Temperature_Sensing_8S_LHS_NTC_Sense_8S13.2)
NTC13_Temperature Sensing 8S RHS: Temperature Sensing 8S RHS (J4_Temperature_Sensing_8S_RHS.4), Temperature Sensing 8S RHS/NTC Sense 8S13 (R25_Temperature_Sensing_8S_RHS_NTC_Sense_8S13.1 R26_Temperature_Sensing_8S_RHS_NTC_Sense_8S13.2)
NTC14_Temperature Sensing 8S LHS: Temperature Sensing 8S LHS (J4_Temperature_Sensing_8S_LHS.3), Temperature Sensing 8S LHS/NTC Sense 8S14 (R25_Temperature_Sensing_8S_LHS_NTC_Sense_8S14.1 R26_Temperature_Sensing_8S_LHS_NTC_Sense_8S14.2)
NTC14_Temperature Sensing 8S RHS: Temperature Sensing 8S RHS (J4_Temperature_Sensing_8S_RHS.3), Temperature Sensing 8S RHS/NTC Sense 8S14 (R25_Temperature_Sensing_8S_RHS_NTC_Sense_8S14.1 R26_Temperature_Sensing_8S_RHS_NTC_Sense_8S14.2)
NTC15_Temperature Sensing 8S LHS: Temperature Sensing 8S LHS (J4_Temperature_Sensing_8S_LHS.2), Temperature Sensing 8S LHS/NTC Sense 8S15 (R25_Temperature_Sensing_8S_LHS_NTC_Sense_8S15.1 R26_Temperature_Sensing_8S_LHS_NTC_Sense_8S15.2)
NTC15_Temperature Sensing 8S RHS: Temperature Sensing 8S RHS (J4_Temperature_Sensing_8S_RHS.2), Temperature Sensing 8S RHS/NTC Sense 8S15 (R25_Temperature_Sensing_8S_RHS_NTC_Sense_8S15.1 R26_Temperature_Sensing_8S_RHS_NTC_Sense_8S15.2)
NTC16_Temperature Sensing 8S LHS: Temperature Sensing 8S LHS (J4_Temperature_Sensing_8S_LHS.1), Temperature Sensing 8S LHS/NTC Sense 8S16 (R25_Temperature_Sensing_8S_LHS_NTC_Sense_8S16.1 R26_Temperature_Sensing_8S_LHS_NTC_Sense_8S16.2)
NTC16_Temperature Sensing 8S RHS: Temperature Sensing 8S RHS (J4_Temperature_Sensing_8S_RHS.1), Temperature Sensing 8S RHS/NTC Sense 8S16 (R25_Temperature_Sensing_8S_RHS_NTC_Sense_8S16.1 R26_Temperature_Sensing_8S_RHS_NTC_Sense_8S16.2)
Out1: Temperature Sensing 12S V0.1 (U5.21), Temperature Sensing 12S RHS/NTC Sense 12S1 (C13_NTC_Sense_12S1.2 R26_NTC_Sense_12S1.1)
Out1_Temperature Sensing 8S LHS: Temperature Sensing 8S LHS (U2_Temperature_Sensing_8S_LHS.16), Temperature Sensing 8S LHS/NTC Sense 8S1 (C13_Temperature_Sensing_8S_LHS_NTC_Sense_8S1.2 R26_Temperature_Sensing_8S_LHS_NTC_Sense_8S1.1)
Out1_Temperature Sensing 8S RHS: Temperature Sensing 8S RHS (U2_Temperature_Sensing_8S_RHS.16), Temperature Sensing 8S RHS/NTC Sense 8S1 (C13_Temperature_Sensing_8S_RHS_NTC_Sense_8S1.2 R26_Temperature_Sensing_8S_RHS_NTC_Sense_8S1.1)
Out2: Temperature Sensing 12S V0.1 (U5.20), Temperature Sensing 12S RHS/NTC Sense 12S2 (C13_NTC_Sense_12S2.2 R26_NTC_Sense_12S2.1)
Out2_Temperature Sensing 8S LHS: Temperature Sensing 8S LHS (U2_Temperature_Sensing_8S_LHS.17), Temperature Sensing 8S LHS/NTC Sense 8S2 (C13_Temperature_Sensing_8S_LHS_NTC_Sense_8S2.2 R26_Temperature_Sensing_8S_LHS_NTC_Sense_8S2.1)
Out2_Temperature Sensing 8S RHS: Temperature Sensing 8S RHS (U2_Temperature_Sensing_8S_RHS.17), Temperature Sensing 8S RHS/NTC Sense 8S2 (C13_Temperature_Sensing_8S_RHS_NTC_Sense_8S2.2 R26_Temperature_Sensing_8S_RHS_NTC_Sense_8S2.1)
Out3: Temperature Sensing 12S V0.1 (U5.19), Temperature Sensing 12S RHS/NTC Sense 12S3 (C13_NTC_Sense_12S3.2 R26_NTC_Sense_12S3.1)
Out3_Temperature Sensing 8S LHS: Temperature Sensing 8S LHS (U2_Temperature_Sensing_8S_LHS.18), Temperature Sensing 8S LHS/NTC Sense 8S3 (C13_Temperature_Sensing_8S_LHS_NTC_Sense_8S3.2 R26_Temperature_Sensing_8S_LHS_NTC_Sense_8S3.1)
Out3_Temperature Sensing 8S RHS: Temperature Sensing 8S RHS (U2_Temperature_Sensing_8S_RHS.18), Temperature Sensing 8S RHS/NTC Sense 8S3 (C13_Temperature_Sensing_8S_RHS_NTC_Sense_8S3.2 R26_Temperature_Sensing_8S_RHS_NTC_Sense_8S3.1)
Out4: Temperature Sensing 12S V0.1 (U5.18), Temperature Sensing 12S RHS/NTC Sense 12S4 (C13_NTC_Sense_12S4.2 R26_NTC_Sense_12S4.1)
Out4_Temperature Sensing 8S LHS: Temperature Sensing 8S LHS (U2_Temperature_Sensing_8S_LHS.19), Temperature Sensing 8S LHS/NTC Sense 8S4 (C13_Temperature_Sensing_8S_LHS_NTC_Sense_8S4.2 R26_Temperature_Sensing_8S_LHS_NTC_Sense_8S4.1)
Out4_Temperature Sensing 8S RHS: Temperature Sensing 8S RHS (U2_Temperature_Sensing_8S_RHS.19), Temperature Sensing 8S RHS/NTC Sense 8S4 (C13_Temperature_Sensing_8S_RHS_NTC_Sense_8S4.2 R26_Temperature_Sensing_8S_RHS_NTC_Sense_8S4.1)
Out5: Temperature Sensing 12S V0.1 (U5.17), Temperature Sensing 12S RHS/NTC Sense 12S5 (C13_NTC_Sense_12S5.2 R26_NTC_Sense_12S5.1)
Out5_Temperature Sensing 8S LHS: Temperature Sensing 8S LHS (U2_Temperature_Sensing_8S_LHS.20), Temperature Sensing 8S LHS/NTC Sense 8S5 (C13_Temperature_Sensing_8S_LHS_NTC_Sense_8S5.2 R26_Temperature_Sensing_8S_LHS_NTC_Sense_8S5.1)
Out5_Temperature Sensing 8S RHS: Temperature Sensing 8S RHS (U2_Temperature_Sensing_8S_RHS.20), Temperature Sensing 8S RHS/NTC Sense 8S5 (C13_Temperature_Sensing_8S_RHS_NTC_Sense_8S5.2 R26_Temperature_Sensing_8S_RHS_NTC_Sense_8S5.1)
Out6: Temperature Sensing 12S V0.1 (U5.16), Temperature Sensing 12S RHS/NTC Sense 12S6 (C13_NTC_Sense_12S6.2 R26_NTC_Sense_12S6.1)
Out6_Temperature Sensing 8S LHS: Temperature Sensing 8S LHS (U2_Temperature_Sensing_8S_LHS.21), Temperature Sensing 8S LHS/NTC Sense 8S6 (C13_Temperature_Sensing_8S_LHS_NTC_Sense_8S6.2 R26_Temperature_Sensing_8S_LHS_NTC_Sense_8S6.1)
Out6_Temperature Sensing 8S RHS: Temperature Sensing 8S RHS (U2_Temperature_Sensing_8S_RHS.21), Temperature Sensing 8S RHS/NTC Sense 8S6 (C13_Temperature_Sensing_8S_RHS_NTC_Sense_8S6.2 R26_Temperature_Sensing_8S_RHS_NTC_Sense_8S6.1)
Out7: Temperature Sensing 12S V0.1 (U5.22), Temperature Sensing 12S RHS/NTC Sense 12S7 (C13_NTC_Sense_12S7.2 R26_NTC_Sense_12S7.1)
Out7_Temperature Sensing 8S LHS: Temperature Sensing 8S LHS (U2_Temperature_Sensing_8S_LHS.22), Temperature Sensing 8S LHS/NTC Sense 8S7 (C13_Temperature_Sensing_8S_LHS_NTC_Sense_8S7.2 R26_Temperature_Sensing_8S_LHS_NTC_Sense_8S7.1)
Out7_Temperature Sensing 8S RHS: Temperature Sensing 8S RHS (U2_Temperature_Sensing_8S_RHS.22), Temperature Sensing 8S RHS/NTC Sense 8S7 (C13_Temperature_Sensing_8S_RHS_NTC_Sense_8S7.2 R26_Temperature_Sensing_8S_RHS_NTC_Sense_8S7.1)
Out8: Temperature Sensing 12S V0.1 (U5.23), Temperature Sensing 12S RHS/NTC Sense 12S8 (C13_NTC_Sense_12S8.2 R26_NTC_Sense_12S8.1)
Out8_Temperature Sensing 8S LHS: Temperature Sensing 8S LHS (U2_Temperature_Sensing_8S_LHS.23), Temperature Sensing 8S LHS/NTC Sense 8S8 (C13_Temperature_Sensing_8S_LHS_NTC_Sense_8S8.2 R26_Temperature_Sensing_8S_LHS_NTC_Sense_8S8.1)
Out8_Temperature Sensing 8S RHS: Temperature Sensing 8S RHS (U2_Temperature_Sensing_8S_RHS.23), Temperature Sensing 8S RHS/NTC Sense 8S8 (C13_Temperature_Sensing_8S_RHS_NTC_Sense_8S8.2 R26_Temperature_Sensing_8S_RHS_NTC_Sense_8S8.1)
Out9: Temperature Sensing 12S V0.1 (U5.9), Temperature Sensing 12S RHS/NTC Sense 12S9 (C13_NTC_Sense_12S9.2 R26_NTC_Sense_12S9.1)
Out9_Temperature Sensing 8S LHS: Temperature Sensing 8S LHS (U2_Temperature_Sensing_8S_LHS.9), Temperature Sensing 8S LHS/NTC Sense 8S9 (C13_Temperature_Sensing_8S_LHS_NTC_Sense_8S9.2 R26_Temperature_Sensing_8S_LHS_NTC_Sense_8S9.1)
Out9_Temperature Sensing 8S RHS: Temperature Sensing 8S RHS (U2_Temperature_Sensing_8S_RHS.9), Temperature Sensing 8S RHS/NTC Sense 8S9 (C13_Temperature_Sensing_8S_RHS_NTC_Sense_8S9.2 R26_Temperature_Sensing_8S_RHS_NTC_Sense_8S9.1)
Out10: Temperature Sensing 12S V0.1 (U5.8), Temperature Sensing 12S RHS/NTC Sense 12S10 (C13_NTC_Sense_12S10.2 R26_NTC_Sense_12S10.1)
Out10_Temperature Sensing 8S LHS: Temperature Sensing 8S LHS (U2_Temperature_Sensing_8S_LHS.8), Temperature Sensing 8S LHS/NTC Sense 8S10 (C13_Temperature_Sensing_8S_LHS_NTC_Sense_8S10.2 R26_Temperature_Sensing_8S_LHS_NTC_Sense_8S10.1)
Out10_Temperature Sensing 8S RHS: Temperature Sensing 8S RHS (U2_Temperature_Sensing_8S_RHS.8), Temperature Sensing 8S RHS/NTC Sense 8S10 (C13_Temperature_Sensing_8S_RHS_NTC_Sense_8S10.2 R26_Temperature_Sensing_8S_RHS_NTC_Sense_8S10.1)
Out11: Temperature Sensing 12S V0.1 (U5.7), Temperature Sensing 12S RHS/NTC Sense 12S11 (C13_NTC_Sense_12S11.2 R26_NTC_Sense_12S11.1)
Out11_Temperature Sensing 8S LHS: Temperature Sensing 8S LHS (U2_Temperature_Sensing_8S_LHS.7), Temperature Sensing 8S LHS/NTC Sense 8S11 (C13_Temperature_Sensing_8S_LHS_NTC_Sense_8S11.2 R26_Temperature_Sensing_8S_LHS_NTC_Sense_8S11.1)
Out11_Temperature Sensing 8S RHS: Temperature Sensing 8S RHS (U2_Temperature_Sensing_8S_RHS.7), Temperature Sensing 8S RHS/NTC Sense 8S11 (C13_Temperature_Sensing_8S_RHS_NTC_Sense_8S11.2 R26_Temperature_Sensing_8S_RHS_NTC_Sense_8S11.1)
Out12: Temperature Sensing 12S V0.1 (U5.6), Temperature Sensing 12S RHS/NTC Sense 12S12 (C13_NTC_Sense_12S12.2 R26_NTC_Sense_12S12.1)
Out12_Temperature Sensing 8S LHS: Temperature Sensing 8S LHS (U2_Temperature_Sensing_8S_LHS.6), Temperature Sensing 8S LHS/NTC Sense 8S12 (C13_Temperature_Sensing_8S_LHS_NTC_Sense_8S12.2 R26_Temperature_Sensing_8S_LHS_NTC_Sense_8S12.1)
Out12_Temperature Sensing 8S RHS: Temperature Sensing 8S RHS (U2_Temperature_Sensing_8S_RHS.6), Temperature Sensing 8S RHS/NTC Sense 8S12 (C13_Temperature_Sensing_8S_RHS_NTC_Sense_8S12.2 R26_Temperature_Sensing_8S_RHS_NTC_Sense_8S12.1)
Out13_Temperature Sensing 8S LHS: Temperature Sensing 8S LHS (U2_Temperature_Sensing_8S_LHS.5), Temperature Sensing 8S LHS/NTC Sense 8S13 (C13_Temperature_Sensing_8S_LHS_NTC_Sense_8S13.2 R26_Temperature_Sensing_8S_LHS_NTC_Sense_8S13.1)
Out13_Temperature Sensing 8S RHS: Temperature Sensing 8S RHS (U2_Temperature_Sensing_8S_RHS.5), Temperature Sensing 8S RHS/NTC Sense 8S13 (C13_Temperature_Sensing_8S_RHS_NTC_Sense_8S13.2 R26_Temperature_Sensing_8S_RHS_NTC_Sense_8S13.1)
Out14_Temperature Sensing 8S LHS: Temperature Sensing 8S LHS (U2_Temperature_Sensing_8S_LHS.4), Temperature Sensing 8S LHS/NTC Sense 8S14 (C13_Temperature_Sensing_8S_LHS_NTC_Sense_8S14.2 R26_Temperature_Sensing_8S_LHS_NTC_Sense_8S14.1)
Out14_Temperature Sensing 8S RHS: Temperature Sensing 8S RHS (U2_Temperature_Sensing_8S_RHS.4), Temperature Sensing 8S RHS/NTC Sense 8S14 (C13_Temperature_Sensing_8S_RHS_NTC_Sense_8S14.2 R26_Temperature_Sensing_8S_RHS_NTC_Sense_8S14.1)
Out15_Temperature Sensing 8S LHS: Temperature Sensing 8S LHS (U2_Temperature_Sensing_8S_LHS.3), Temperature Sensing 8S LHS/NTC Sense 8S15 (C13_Temperature_Sensing_8S_LHS_NTC_Sense_8S15.2 R26_Temperature_Sensing_8S_LHS_NTC_Sense_8S15.1)
Out15_Temperature Sensing 8S RHS: Temperature Sensing 8S RHS (U2_Temperature_Sensing_8S_RHS.3), Temperature Sensing 8S RHS/NTC Sense 8S15 (C13_Temperature_Sensing_8S_RHS_NTC_Sense_8S15.2 R26_Temperature_Sensing_8S_RHS_NTC_Sense_8S15.1)
Out16_Temperature Sensing 8S LHS: Temperature Sensing 8S LHS (U2_Temperature_Sensing_8S_LHS.2), Temperature Sensing 8S LHS/NTC Sense 8S16 (C13_Temperature_Sensing_8S_LHS_NTC_Sense_8S16.2 R26_Temperature_Sensing_8S_LHS_NTC_Sense_8S16.1)
Out16_Temperature Sensing 8S RHS: Temperature Sensing 8S RHS (U2_Temperature_Sensing_8S_RHS.2), Temperature Sensing 8S RHS/NTC Sense 8S16 (C13_Temperature_Sensing_8S_RHS_NTC_Sense_8S16.2 R26_Temperature_Sensing_8S_RHS_NTC_Sense_8S16.1)
S8L_1: Cell Monitor 8S LHS V0.1 (U3.25), Cell Monitor 8S LHS/Balance Circuit 8L1 (R20_Balance_Circuit_8L1.2)
S8L_2: Cell Monitor 8S LHS V0.1 (U3.23), Cell Monitor 8S LHS/Balance Circuit 8L2 (R20_Balance_Circuit_8L2.2)
S8L_3: Cell Monitor 8S LHS V0.1 (U3.21), Cell Monitor 8S LHS/Balance Circuit 8L3 (R20_Balance_Circuit_8L3.2)
S8L_4: Cell Monitor 8S LHS V0.1 (U3.19), Cell Monitor 8S LHS/Balance Circuit 8L4 (R20_Balance_Circuit_8L4.2)
S8L_5: Cell Monitor 8S LHS V0.1 (U3.13), Cell Monitor 8S LHS/Balance Circuit 8L5 (R20_Balance_Circuit_8L5.2)
S8L_6: Cell Monitor 8S LHS V0.1 (U3.11), Cell Monitor 8S LHS/Balance Circuit 8L6 (R20_Balance_Circuit_8L6.2)
S8L_7: Cell Monitor 8S LHS V0.1 (U3.9), Cell Monitor 8S LHS/Balance Circuit 8L7 (R20_Balance_Circuit_8L7.2)
S8L_8: Cell Monitor 8S LHS V0.1 (U3.7), Cell Monitor 8S LHS/Balance Circuit 8L8 (R20_Balance_Circuit_8L8.2)
S8R_1: Cell Monitor 8S RHS V0.1 (U4.25), Cell Monitor 8S RHS/Balance Circuit 8R1 (R20_Balance_Circuit_8R1.2)
S8R_2: Cell Monitor 8S RHS V0.1 (U4.23), Cell Monitor 8S RHS/Balance Circuit 8R2 (R20_Balance_Circuit_8R2.2)
S8R_3: Cell Monitor 8S RHS V0.1 (U4.21), Cell Monitor 8S RHS/Balance Circuit 8R3 (R20_Balance_Circuit_8R3.2)
S8R_4: Cell Monitor 8S RHS V0.1 (U4.19), Cell Monitor 8S RHS/Balance Circuit 8R4 (R20_Balance_Circuit_8R4.2)
S8R_5: Cell Monitor 8S RHS V0.1 (U4.13), Cell Monitor 8S RHS/Balance Circuit 8R5 (R20_Balance_Circuit_8R5.2)
S8R_6: Cell Monitor 8S RHS V0.1 (U4.11), Cell Monitor 8S RHS/Balance Circuit 8R6 (R20_Balance_Circuit_8R6.2)
S8R_7: Cell Monitor 8S RHS V0.1 (U4.9), Cell Monitor 8S RHS/Balance Circuit 8R7 (R20_Balance_Circuit_8R7.2)
S8R_8: Cell Monitor 8S RHS V0.1 (U4.7), Cell Monitor 8S RHS/Balance Circuit 8R8 (R20_Balance_Circuit_8R8.2)
S12_1: Cell Monitor 12S V0.1 (U1.25), Cell Monitor 12S/Balance Circuit 121 (R20_Balance_Circuit_121.2)
S12_2: Cell Monitor 12S V0.1 (U1.23), Cell Monitor 12S/Balance Circuit 122 (R20_Balance_Circuit_122.2)
S12_3: Cell Monitor 12S V0.1 (U1.21), Cell Monitor 12S/Balance Circuit 123 (R20_Balance_Circuit_123.2)
S12_4: Cell Monitor 12S V0.1 (U1.19), Cell Monitor 12S/Balance Circuit 124 (R20_Balance_Circuit_124.2)
S12_5: Cell Monitor 12S V0.1 (U1.17), Cell Monitor 12S/Balance Circuit 125 (R20_Balance_Circuit_125.2)
S12_6: Cell Monitor 12S V0.1 (U1.15), Cell Monitor 12S/Balance Circuit 126 (R20_Balance_Circuit_126.2)
S12_7: Cell Monitor 12S V0.1 (U1.13), Cell Monitor 12S/Balance Circuit 127 (R20_Balance_Circuit_127.2)
S12_8: Cell Monitor 12S V0.1 (U1.11), Cell Monitor 12S/Balance Circuit 128 (R20_Balance_Circuit_128.2)
S12_9: Cell Monitor 12S V0.1 (U1.9), Cell Monitor 12S/Balance Circuit 129 (R20_Balance_Circuit_129.2)
S12_10: Cell Monitor 12S V0.1 (U1.7), Cell Monitor 12S/Balance Circuit 1210 (R20_Balance_Circuit_1210.2)
S12_11: Cell Monitor 12S V0.1 (U1.5), Cell Monitor 12S/Balance Circuit 1211 (R20_Balance_Circuit_1211.2)
S12_12: Cell Monitor 12S V0.1 (U1.3), Cell Monitor 12S/Balance Circuit 1212 (R20_Balance_Circuit_1212.2)
T8L_8: Cell Monitor 8S LHS V0.1 (NT4.1), Cell Monitor 8S LHS/Balance Circuit 8L8 (F2_Balance_Circuit_8L8.2 Q2_Balance_Circuit_8L8.2 R19_Balance_Circuit_8L8.1)
T8R_8: Cell Monitor 8S RHS V0.1 (NT6.1), Cell Monitor 8S RHS/Balance Circuit 8R8 (F2_Balance_Circuit_8R8.2 Q2_Balance_Circuit_8R8.2 R19_Balance_Circuit_8R8.1)
T12_12: Cell Monitor 12S V0.1 (NT2.1), Cell Monitor 12S/Balance Circuit 1212 (F2_Balance_Circuit_1212.2 Q2_Balance_Circuit_1212.2 R19_Balance_Circuit_1212.1)
V8L_1: Cell Monitor 8S LHS V0.1 (J8.3), Cell Monitor 8S LHS/Balance Circuit 8L1 (F2_Balance_Circuit_8L1.1)
V8L_2: Cell Monitor 8S LHS V0.1 (J8.2), Cell Monitor 8S LHS/Balance Circuit 8L2 (F2_Balance_Circuit_8L2.1)
V8L_3: Cell Monitor 8S LHS V0.1 (J8.1), Cell Monitor 8S LHS/Balance Circuit 8L3 (F2_Balance_Circuit_8L3.1)
V8L_4: Cell Monitor 8S LHS V0.1 (J7.7), Cell Monitor 8S LHS/Balance Circuit 8L4 (F2_Balance_Circuit_8L4.1)
V8L_5: Cell Monitor 8S LHS V0.1 (J7.6), Cell Monitor 8S LHS/Balance Circuit 8L5 (F2_Balance_Circuit_8L5.1)
V8L_6: Cell Monitor 8S LHS V0.1 (J7.5), Cell Monitor 8S LHS/Balance Circuit 8L6 (F2_Balance_Circuit_8L6.1)
V8L_7: Cell Monitor 8S LHS V0.1 (J7.4), Cell Monitor 8S LHS/Balance Circuit 8L7 (F2_Balance_Circuit_8L7.1)
V8L_8: Cell Monitor 8S LHS V0.1 (J7.1 J7.2 J7.3), Cell Monitor 8S LHS/Balance Circuit 8L8 (F2_Balance_Circuit_8L8.1)
V8R_1: Cell Monitor 8S RHS V0.1 (J10.3), Cell Monitor 8S RHS/Balance Circuit 8R1 (F2_Balance_Circuit_8R1.1)
V8R_2: Cell Monitor 8S RHS V0.1 (J10.2), Cell Monitor 8S RHS/Balance Circuit 8R2 (F2_Balance_Circuit_8R2.1)
V8R_3: Cell Monitor 8S RHS V0.1 (J10.1), Cell Monitor 8S RHS/Balance Circuit 8R3 (F2_Balance_Circuit_8R3.1)
V8R_4: Cell Monitor 8S RHS V0.1 (J9.7), Cell Monitor 8S RHS/Balance Circuit 8R4 (F2_Balance_Circuit_8R4.1)
V8R_5: Cell Monitor 8S RHS V0.1 (J9.6), Cell Monitor 8S RHS/Balance Circuit 8R5 (F2_Balance_Circuit_8R5.1)
V8R_6: Cell Monitor 8S RHS V0.1 (J9.5), Cell Monitor 8S RHS/Balance Circuit 8R6 (F2_Balance_Circuit_8R6.1)
V8R_7: Cell Monitor 8S RHS V0.1 (J9.4), Cell Monitor 8S RHS/Balance Circuit 8R7 (F2_Balance_Circuit_8R7.1)
V8R_8: Cell Monitor 8S RHS V0.1 (J9.1 J9.2 J9.3), Cell Monitor 8S RHS/Balance Circuit 8R8 (F2_Balance_Circuit_8R8.1)
V12_1: Cell Monitor 12S V0.1 (J1.5), Cell Monitor 12S/Balance Circuit 121 (F2_Balance_Circuit_121.1)
V12_2: Cell Monitor 12S V0.1 (J1.4), Cell Monitor 12S/Balance Circuit 122 (F2_Balance_Circuit_122.1)
V12_3: Cell Monitor 12S V0.1 (J1.3), Cell Monitor 12S/Balance Circuit 123 (F2_Balance_Circuit_123.1)
V12_4: Cell Monitor 12S V0.1 (J1.2), Cell Monitor 12S/Balance Circuit 124 (F2_Balance_Circuit_124.1)
V12_5: Cell Monitor 12S V0.1 (J1.1), Cell Monitor 12S/Balance Circuit 125 (F2_Balance_Circuit_125.1)
V12_6: Cell Monitor 12S V0.1 (J2.7), Cell Monitor 12S/Balance Circuit 126 (F2_Balance_Circuit_126.1)
V12_7: Cell Monitor 12S V0.1 (J2.6), Cell Monitor 12S/Balance Circuit 127 (F2_Balance_Circuit_127.1)
V12_8: Cell Monitor 12S V0.1 (J2.5), Cell Monitor 12S/Balance Circuit 128 (F2_Balance_Circuit_128.1)
V12_9: Cell Monitor 12S V0.1 (J2.4), Cell Monitor 12S/Balance Circuit 129 (F2_Balance_Circuit_129.1)
V12_10: Cell Monitor 12S V0.1 (J2.3), Cell Monitor 12S/Balance Circuit 1210 (F2_Balance_Circuit_1210.1)
V12_11: Cell Monitor 12S V0.1 (J2.2), Cell Monitor 12S/Balance Circuit 1211 (F2_Balance_Circuit_1211.1)
V12_12: Cell Monitor 12S V0.1 (J2.1), Cell Monitor 12S/Balance Circuit 1212 (F2_Balance_Circuit_1212.1)

## Assembly variants
Manufacture: not fitted C3 C4 C9_IsoSPI 8S LHS C9_IsoSPI 8S RHS C9_IsoSPI 12S C16 C17 C23 C24 R6 R10 R11 R12 R13 R14 R15 R16 R17 R23_IsoSPI 8S LHS R23_IsoSPI 8S RHS R23_IsoSPI 12S R24_IsoSPI 8S LHS R24_IsoSPI 8S RHS R24_IsoSPI 12S R32 R36 R37 R38 R39 R40 R41 R42 R43 R50 R54 R55 R56 R57 R58 R59 R60 R61